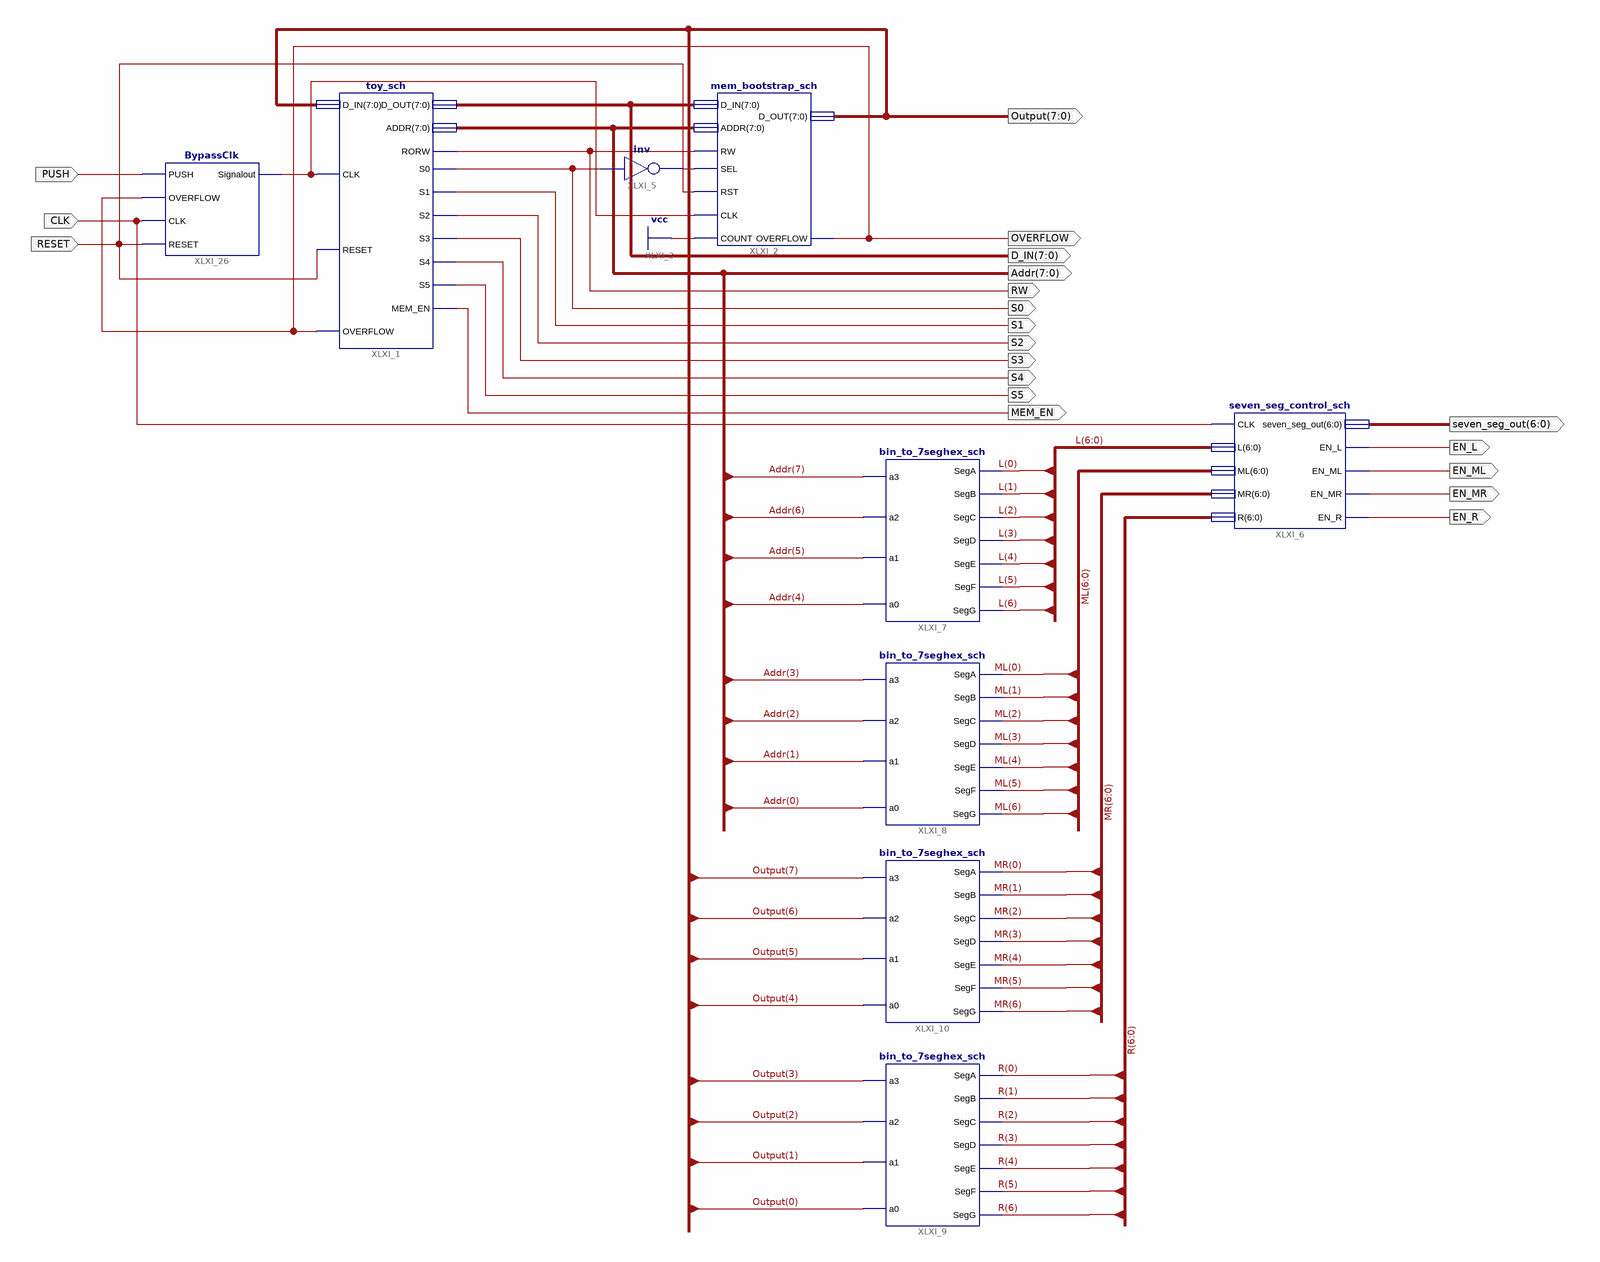
[diagram p0: schematic sheet 1]
// Xilinx ISE schematic toyProcessor_overall.sch (spartan3e) as structural Verilog: 9 symbols, 20 ports
module toyProcessor_overall (
  input  CLK,
  input  RESET,
  input  PUSH,
  output [7:0] Output,
  output [7:0] Addr,
  output RW,
  output S1,
  output S2,
  output S3,
  output S4,
  output S5,
  output MEM_EN,
  output [7:0] D_IN,
  output S0,
  output [6:0] seven_seg_out,
  output EN_L,
  output EN_ML,
  output EN_MR,
  output EN_R,
  output OVERFLOW
);

  wire XLXN_21, XLXN_155;
  wire [6:0] L, ML, MR, R;

  mem_bootstrap_sch XLXI_2 (
    .SEL(XLXN_21), .CLK(XLXN_155), .RW(RW), .RST(RESET), .D_IN(D_IN), .ADDR(Addr), .COUNT(1'b1),
    .D_OUT(Output), .OVERFLOW(OVERFLOW));
  not XLXI_5 (XLXN_21, S0);
  toy_sch XLXI_1 (
    .D_IN(Output), .CLK(XLXN_155), .RESET(RESET), .OVERFLOW(OVERFLOW), .RORW(RW), .MEM_EN(MEM_EN), .S0(S0),
    .S1(S1), .S2(S2), .S3(S3), .S4(S4), .S5(S5), .D_OUT(D_IN), .ADDR(Addr));
  bin_to_7seghex_sch XLXI_8 (
    .SegA(ML[0]), .SegB(ML[1]), .SegC(ML[2]), .SegD(ML[3]), .SegE(ML[4]), .SegF(ML[5]), .SegG(ML[6]),
    .a3(Addr[3]), .a0(Addr[0]), .a1(Addr[1]), .a2(Addr[2]));
  bin_to_7seghex_sch XLXI_10 (
    .SegA(MR[0]), .SegB(MR[1]), .SegC(MR[2]), .SegD(MR[3]), .SegE(MR[4]), .SegF(MR[5]), .SegG(MR[6]),
    .a3(Output[7]), .a0(Output[4]), .a1(Output[5]), .a2(Output[6]));
  bin_to_7seghex_sch XLXI_9 (
    .SegA(R[0]), .SegB(R[1]), .SegC(R[2]), .SegD(R[3]), .SegE(R[4]), .SegF(R[5]), .SegG(R[6]),
    .a3(Output[3]), .a0(Output[0]), .a1(Output[1]), .a2(Output[2]));
  bin_to_7seghex_sch XLXI_7 (
    .SegA(L[0]), .SegB(L[1]), .SegC(L[2]), .SegD(L[3]), .SegE(L[4]), .SegF(L[5]), .SegG(L[6]), .a3(Addr[7]),
    .a0(Addr[4]), .a1(Addr[5]), .a2(Addr[6]));
  seven_seg_control_sch XLXI_6 (
    .CLK(CLK), .L(L), .ML(ML), .MR(MR), .R(R), .EN_MR(EN_MR), .EN_L(EN_L), .EN_ML(EN_ML), .EN_R(EN_R),
    .seven_seg_out(seven_seg_out));
  BypassClk XLXI_26 (.PUSH(PUSH), .OVERFLOW(OVERFLOW), .CLK(CLK), .RESET(RESET), .Signalout(XLXN_155));
endmodule
